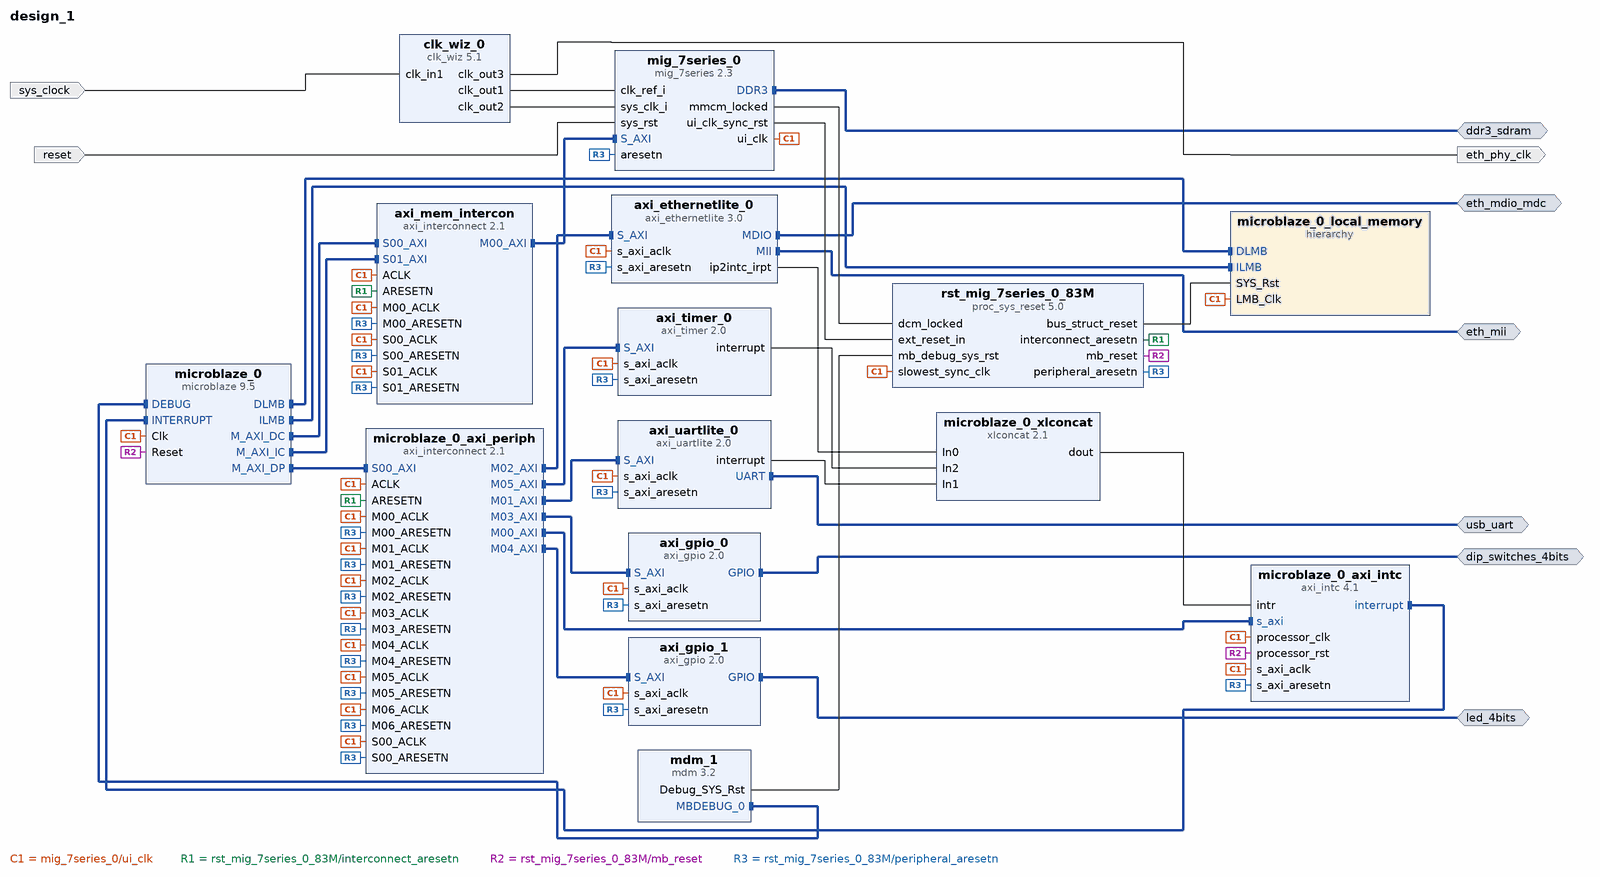
[diagram p0: block diagram of the top level]
# Vivado block design design_1, Vivado 2015.2
create_bd_design design_1

create_bd_intf_port -mode Master -vlnv xilinx.com:interface:ddrx_rtl:1.0 ddr3_sdram
create_bd_intf_port -mode Master -vlnv xilinx.com:interface:gpio_rtl:1.0 dip_switches_4bits
create_bd_intf_port -mode Master -vlnv xilinx.com:interface:mdio_rtl:1.0 eth_mdio_mdc
create_bd_intf_port -mode Master -vlnv xilinx.com:interface:mii_rtl:1.0 eth_mii
create_bd_intf_port -mode Master -vlnv xilinx.com:interface:gpio_rtl:1.0 led_4bits
create_bd_intf_port -mode Master -vlnv xilinx.com:interface:uart_rtl:1.0 usb_uart
create_bd_port -dir O -type clk eth_phy_clk
create_bd_port -dir I -type rst reset
set_property -dict {CONFIG.POLARITY ACTIVE_LOW} [get_bd_ports reset]
create_bd_port -dir I -type clk sys_clock
set_property -dict {CONFIG.FREQ_HZ 100000000 CONFIG.PHASE 0.000} [get_bd_ports sys_clock]

create_bd_cell -type ip -vlnv xilinx.com:ip:axi_ethernetlite:3.0 axi_ethernetlite_0
set_property -dict [list \
  CONFIG.C_S_AXI_PROTOCOL AXI4 \
  CONFIG.USE_BOARD_FLOW true \
  CONFIG.MII_BOARD_INTERFACE eth_mii \
  CONFIG.MDIO_BOARD_INTERFACE eth_mdio_mdc \
] [get_bd_cells axi_ethernetlite_0]
create_bd_cell -type ip -vlnv xilinx.com:ip:axi_gpio:2.0 axi_gpio_0
set_property -dict {CONFIG.USE_BOARD_FLOW true CONFIG.GPIO_BOARD_INTERFACE dip_switches_4bits} [get_bd_cells axi_gpio_0]
create_bd_cell -type ip -vlnv xilinx.com:ip:axi_gpio:2.0 axi_gpio_1
set_property -dict {CONFIG.USE_BOARD_FLOW true CONFIG.GPIO_BOARD_INTERFACE led_4bits} [get_bd_cells axi_gpio_1]
create_bd_cell -type ip -vlnv xilinx.com:ip:axi_interconnect:2.1 axi_mem_intercon
set_property -dict {CONFIG.NUM_SI 2 CONFIG.NUM_MI 1} [get_bd_cells axi_mem_intercon]
create_bd_cell -type ip -vlnv xilinx.com:ip:axi_timer:2.0 axi_timer_0
create_bd_cell -type ip -vlnv xilinx.com:ip:axi_uartlite:2.0 axi_uartlite_0
set_property -dict [list \
  CONFIG.C_BAUDRATE 115200 \
  CONFIG.USE_BOARD_FLOW true \
  CONFIG.UARTLITE_BOARD_INTERFACE usb_uart \
] [get_bd_cells axi_uartlite_0]
create_bd_cell -type ip -vlnv xilinx.com:ip:clk_wiz:5.1 clk_wiz_0
set_property -dict [list \
  CONFIG.CLKOUT2_USED true \
  CONFIG.CLKOUT3_USED true \
  CONFIG.NUM_OUT_CLKS 3 \
  CONFIG.CLKOUT1_REQUESTED_OUT_FREQ 200.000 \
  CONFIG.CLKOUT2_REQUESTED_OUT_FREQ 166.667 \
  CONFIG.CLKOUT3_REQUESTED_OUT_FREQ 25.000 \
  CONFIG.USE_LOCKED false \
  CONFIG.USE_RESET false \
  CONFIG.MMCM_DIVCLK_DIVIDE 1 \
  CONFIG.MMCM_CLKOUT0_DIVIDE_F 5.000 \
  CONFIG.MMCM_CLKOUT1_DIVIDE 6 \
  CONFIG.MMCM_CLKOUT2_DIVIDE 40 \
  CONFIG.USE_BOARD_FLOW true \
  CONFIG.CLK_IN1_BOARD_INTERFACE sys_clock \
  CONFIG.CLKOUT1_JITTER 114.829 \
  CONFIG.CLKOUT2_JITTER 118.758 \
  CONFIG.CLKOUT2_PHASE_ERROR 98.575 \
  CONFIG.CLKOUT3_JITTER 175.402 \
  CONFIG.CLKOUT3_PHASE_ERROR 98.575 \
] [get_bd_cells clk_wiz_0]
create_bd_cell -type ip -vlnv xilinx.com:ip:mdm:3.2 mdm_1
create_bd_cell -type ip -vlnv xilinx.com:ip:microblaze:9.5 microblaze_0
set_property -dict [list \
  CONFIG.C_AREA_OPTIMIZED 0 \
  CONFIG.C_D_AXI 1 \
  CONFIG.C_D_LMB 1 \
  CONFIG.C_I_LMB 1 \
  CONFIG.G_TEMPLATE_LIST 6 \
  CONFIG.G_USE_EXCEPTIONS 1 \
  CONFIG.C_USE_MSR_INSTR 1 \
  CONFIG.C_USE_PCMP_INSTR 1 \
  CONFIG.C_USE_BARREL 1 \
  CONFIG.C_USE_DIV 1 \
  CONFIG.C_USE_HW_MUL 1 \
  CONFIG.C_UNALIGNED_EXCEPTIONS 0 \
  CONFIG.C_ILL_OPCODE_EXCEPTION 0 \
  CONFIG.C_M_AXI_I_BUS_EXCEPTION 0 \
  CONFIG.C_M_AXI_D_BUS_EXCEPTION 1 \
  CONFIG.C_DEBUG_ENABLED 1 \
  CONFIG.C_NUMBER_OF_PC_BRK 2 \
  CONFIG.C_OPCODE_0x0_ILLEGAL 0 \
  CONFIG.C_USE_ICACHE 1 \
  CONFIG.C_CACHE_BYTE_SIZE 32768 \
  CONFIG.C_ICACHE_LINE_LEN 8 \
  CONFIG.C_USE_DCACHE 1 \
  CONFIG.C_DCACHE_BYTE_SIZE 32768 \
  CONFIG.C_DCACHE_LINE_LEN 8 \
  CONFIG.C_USE_MMU 0 \
  CONFIG.C_USE_BRANCH_TARGET_CACHE 0 \
] [get_bd_cells microblaze_0]
create_bd_cell -type ip -vlnv xilinx.com:ip:axi_intc:4.1 microblaze_0_axi_intc
set_property -dict {CONFIG.C_HAS_FAST 1} [get_bd_cells microblaze_0_axi_intc]
create_bd_cell -type ip -vlnv xilinx.com:ip:axi_interconnect:2.1 microblaze_0_axi_periph
set_property -dict {CONFIG.NUM_MI 7} [get_bd_cells microblaze_0_axi_periph]
create_bd_cell -type hier microblaze_0_local_memory
create_bd_cell -type ip -vlnv xilinx.com:ip:xlconcat:2.1 microblaze_0_xlconcat
set_property -dict {CONFIG.NUM_PORTS 3} [get_bd_cells microblaze_0_xlconcat]
create_bd_cell -type ip -vlnv xilinx.com:ip:mig_7series:2.3 mig_7series_0
set_property -dict {CONFIG.RESET_BOARD_INTERFACE reset CONFIG.BOARD_MIG_PARAM ddr3_sdram} [get_bd_cells mig_7series_0]
create_bd_cell -type ip -vlnv xilinx.com:ip:proc_sys_reset:5.0 rst_mig_7series_0_83M

# ---- hierarchy /microblaze_0_local_memory ----
current_bd_instance /microblaze_0_local_memory
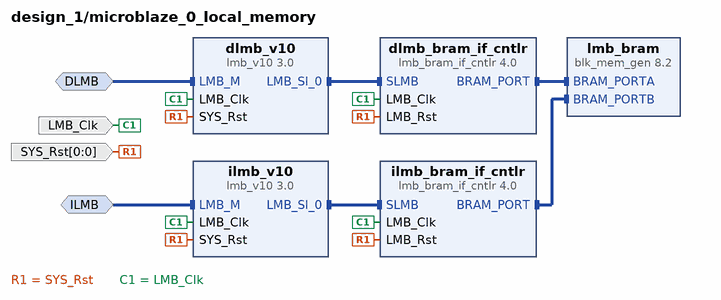
[diagram p1: block diagram inside /microblaze_0_local_memory]
create_bd_intf_pin -mode MirroredMaster -vlnv xilinx.com:interface:lmb_rtl:1.0 DLMB
create_bd_intf_pin -mode MirroredMaster -vlnv xilinx.com:interface:lmb_rtl:1.0 ILMB
create_bd_pin -dir I -type clk LMB_Clk
create_bd_pin -dir I -from 0 -to 0 -type rst SYS_Rst

create_bd_cell -type ip -vlnv xilinx.com:ip:lmb_bram_if_cntlr:4.0 dlmb_bram_if_cntlr
set_property -dict {CONFIG.C_ECC 0} [get_bd_cells dlmb_bram_if_cntlr]
create_bd_cell -type ip -vlnv xilinx.com:ip:lmb_v10:3.0 dlmb_v10
create_bd_cell -type ip -vlnv xilinx.com:ip:lmb_bram_if_cntlr:4.0 ilmb_bram_if_cntlr
set_property -dict {CONFIG.C_ECC 0} [get_bd_cells ilmb_bram_if_cntlr]
create_bd_cell -type ip -vlnv xilinx.com:ip:lmb_v10:3.0 ilmb_v10
create_bd_cell -type ip -vlnv xilinx.com:ip:blk_mem_gen:8.2 lmb_bram
set_property -dict {CONFIG.Memory_Type True_Dual_Port_RAM CONFIG.use_bram_block BRAM_Controller} [get_bd_cells lmb_bram]

# ---- connections ----

current_bd_instance /microblaze_0_local_memory
connect_bd_intf_net -intf_net microblaze_0_dlmb_bus [get_bd_intf_pins dlmb_bram_if_cntlr/SLMB] [get_bd_intf_pins dlmb_v10/LMB_Sl_0]
connect_bd_intf_net -intf_net microblaze_0_dlmb_cntlr [get_bd_intf_pins dlmb_bram_if_cntlr/BRAM_PORT] [get_bd_intf_pins lmb_bram/BRAM_PORTA]
connect_bd_intf_net -intf_net microblaze_0_ilmb_bus [get_bd_intf_pins ilmb_bram_if_cntlr/SLMB] [get_bd_intf_pins ilmb_v10/LMB_Sl_0]
connect_bd_intf_net -intf_net microblaze_0_ilmb_cntlr [get_bd_intf_pins ilmb_bram_if_cntlr/BRAM_PORT] [get_bd_intf_pins lmb_bram/BRAM_PORTB]
connect_bd_intf_net -intf_net microblaze_0_dlmb [get_bd_intf_pins DLMB] [get_bd_intf_pins dlmb_v10/LMB_M]
connect_bd_intf_net -intf_net microblaze_0_ilmb [get_bd_intf_pins ILMB] [get_bd_intf_pins ilmb_v10/LMB_M]
connect_bd_net [get_bd_pins SYS_Rst] \
  [get_bd_pins dlmb_bram_if_cntlr/LMB_Rst] [get_bd_pins dlmb_v10/SYS_Rst] [get_bd_pins ilmb_bram_if_cntlr/LMB_Rst] \
  [get_bd_pins ilmb_v10/SYS_Rst]
connect_bd_net -net microblaze_0_Clk [get_bd_pins LMB_Clk] \
  [get_bd_pins dlmb_bram_if_cntlr/LMB_Clk] [get_bd_pins dlmb_v10/LMB_Clk] [get_bd_pins ilmb_bram_if_cntlr/LMB_Clk] \
  [get_bd_pins ilmb_v10/LMB_Clk]

current_bd_instance /
connect_bd_intf_net [get_bd_intf_pins axi_mem_intercon/M00_AXI] [get_bd_intf_pins mig_7series_0/S_AXI]
connect_bd_intf_net [get_bd_intf_pins axi_mem_intercon/S00_AXI] [get_bd_intf_pins microblaze_0/M_AXI_DC]
connect_bd_intf_net [get_bd_intf_pins axi_mem_intercon/S01_AXI] [get_bd_intf_pins microblaze_0/M_AXI_IC]
connect_bd_intf_net -intf_net microblaze_0_axi_dp [get_bd_intf_pins microblaze_0/M_AXI_DP] [get_bd_intf_pins microblaze_0_axi_periph/S00_AXI]
connect_bd_intf_net [get_bd_intf_pins axi_uartlite_0/S_AXI] [get_bd_intf_pins microblaze_0_axi_periph/M01_AXI]
connect_bd_intf_net [get_bd_intf_pins axi_ethernetlite_0/S_AXI] [get_bd_intf_pins microblaze_0_axi_periph/M02_AXI]
connect_bd_intf_net [get_bd_intf_pins axi_gpio_0/S_AXI] [get_bd_intf_pins microblaze_0_axi_periph/M03_AXI]
connect_bd_intf_net [get_bd_intf_pins axi_gpio_1/S_AXI] [get_bd_intf_pins microblaze_0_axi_periph/M04_AXI]
connect_bd_intf_net [get_bd_intf_pins axi_timer_0/S_AXI] [get_bd_intf_pins microblaze_0_axi_periph/M05_AXI]
connect_bd_intf_net [get_bd_intf_pins mdm_1/MBDEBUG_0] [get_bd_intf_pins microblaze_0/DEBUG]
connect_bd_intf_net [get_bd_intf_pins microblaze_0/DLMB] [get_bd_intf_pins microblaze_0_local_memory/DLMB]
connect_bd_intf_net [get_bd_intf_pins microblaze_0/ILMB] [get_bd_intf_pins microblaze_0_local_memory/ILMB]
connect_bd_intf_net -intf_net microblaze_0_intc_axi [get_bd_intf_pins microblaze_0_axi_intc/s_axi] [get_bd_intf_pins microblaze_0_axi_periph/M00_AXI]
connect_bd_intf_net [get_bd_intf_pins microblaze_0/INTERRUPT] [get_bd_intf_pins microblaze_0_axi_intc/interrupt]
connect_bd_intf_net [get_bd_intf_ports ddr3_sdram] [get_bd_intf_pins mig_7series_0/DDR3]
connect_bd_intf_net [get_bd_intf_ports dip_switches_4bits] [get_bd_intf_pins axi_gpio_0/GPIO]
connect_bd_intf_net [get_bd_intf_ports eth_mdio_mdc] [get_bd_intf_pins axi_ethernetlite_0/MDIO]
connect_bd_intf_net [get_bd_intf_ports eth_mii] [get_bd_intf_pins axi_ethernetlite_0/MII]
connect_bd_intf_net [get_bd_intf_ports led_4bits] [get_bd_intf_pins axi_gpio_1/GPIO]
connect_bd_intf_net [get_bd_intf_ports usb_uart] [get_bd_intf_pins axi_uartlite_0/UART]
connect_bd_net [get_bd_pins axi_ethernetlite_0/ip2intc_irpt] [get_bd_pins microblaze_0_xlconcat/In0]
connect_bd_net [get_bd_pins axi_timer_0/interrupt] [get_bd_pins microblaze_0_xlconcat/In2]
connect_bd_net [get_bd_pins axi_uartlite_0/interrupt] [get_bd_pins microblaze_0_xlconcat/In1]
connect_bd_net [get_bd_pins clk_wiz_0/clk_out1] [get_bd_pins mig_7series_0/clk_ref_i]
connect_bd_net [get_bd_pins clk_wiz_0/clk_out2] [get_bd_pins mig_7series_0/sys_clk_i]
connect_bd_net [get_bd_pins clk_wiz_0/clk_out3] [get_bd_ports eth_phy_clk]
connect_bd_net [get_bd_pins mdm_1/Debug_SYS_Rst] [get_bd_pins rst_mig_7series_0_83M/mb_debug_sys_rst]
connect_bd_net -net microblaze_0_Clk [get_bd_pins mig_7series_0/ui_clk] \
  [get_bd_pins axi_ethernetlite_0/s_axi_aclk] [get_bd_pins axi_gpio_0/s_axi_aclk] [get_bd_pins axi_gpio_1/s_axi_aclk] \
  [get_bd_pins axi_mem_intercon/ACLK] [get_bd_pins axi_mem_intercon/M00_ACLK] [get_bd_pins axi_mem_intercon/S00_ACLK] \
  [get_bd_pins axi_mem_intercon/S01_ACLK] [get_bd_pins axi_timer_0/s_axi_aclk] [get_bd_pins axi_uartlite_0/s_axi_aclk] \
  [get_bd_pins microblaze_0/Clk] [get_bd_pins microblaze_0_axi_intc/processor_clk] \
  [get_bd_pins microblaze_0_axi_intc/s_axi_aclk] [get_bd_pins microblaze_0_axi_periph/ACLK] \
  [get_bd_pins microblaze_0_axi_periph/M00_ACLK] [get_bd_pins microblaze_0_axi_periph/M01_ACLK] \
  [get_bd_pins microblaze_0_axi_periph/M02_ACLK] [get_bd_pins microblaze_0_axi_periph/M03_ACLK] \
  [get_bd_pins microblaze_0_axi_periph/M04_ACLK] [get_bd_pins microblaze_0_axi_periph/M05_ACLK] \
  [get_bd_pins microblaze_0_axi_periph/M06_ACLK] [get_bd_pins microblaze_0_axi_periph/S00_ACLK] \
  [get_bd_pins microblaze_0_local_memory/LMB_Clk] [get_bd_pins rst_mig_7series_0_83M/slowest_sync_clk]
connect_bd_net -net microblaze_0_intr [get_bd_pins microblaze_0_xlconcat/dout] [get_bd_pins microblaze_0_axi_intc/intr]
connect_bd_net [get_bd_pins mig_7series_0/mmcm_locked] [get_bd_pins rst_mig_7series_0_83M/dcm_locked]
connect_bd_net [get_bd_pins mig_7series_0/ui_clk_sync_rst] [get_bd_pins rst_mig_7series_0_83M/ext_reset_in]
connect_bd_net [get_bd_ports reset] [get_bd_pins mig_7series_0/sys_rst]
connect_bd_net [get_bd_pins rst_mig_7series_0_83M/bus_struct_reset] [get_bd_pins microblaze_0_local_memory/SYS_Rst]
connect_bd_net [get_bd_pins rst_mig_7series_0_83M/interconnect_aresetn] \
  [get_bd_pins axi_mem_intercon/ARESETN] [get_bd_pins microblaze_0_axi_periph/ARESETN]
connect_bd_net [get_bd_pins rst_mig_7series_0_83M/mb_reset] [get_bd_pins microblaze_0/Reset] [get_bd_pins microblaze_0_axi_intc/processor_rst]
connect_bd_net [get_bd_pins rst_mig_7series_0_83M/peripheral_aresetn] \
  [get_bd_pins axi_ethernetlite_0/s_axi_aresetn] [get_bd_pins axi_gpio_0/s_axi_aresetn] \
  [get_bd_pins axi_gpio_1/s_axi_aresetn] [get_bd_pins axi_mem_intercon/M00_ARESETN] \
  [get_bd_pins axi_mem_intercon/S00_ARESETN] [get_bd_pins axi_mem_intercon/S01_ARESETN] \
  [get_bd_pins axi_timer_0/s_axi_aresetn] [get_bd_pins axi_uartlite_0/s_axi_aresetn] \
  [get_bd_pins microblaze_0_axi_intc/s_axi_aresetn] [get_bd_pins microblaze_0_axi_periph/M00_ARESETN] \
  [get_bd_pins microblaze_0_axi_periph/M01_ARESETN] [get_bd_pins microblaze_0_axi_periph/M02_ARESETN] \
  [get_bd_pins microblaze_0_axi_periph/M03_ARESETN] [get_bd_pins microblaze_0_axi_periph/M04_ARESETN] \
  [get_bd_pins microblaze_0_axi_periph/M05_ARESETN] [get_bd_pins microblaze_0_axi_periph/M06_ARESETN] \
  [get_bd_pins microblaze_0_axi_periph/S00_ARESETN] [get_bd_pins mig_7series_0/aresetn]
connect_bd_net [get_bd_ports sys_clock] [get_bd_pins clk_wiz_0/clk_in1]

# ---- address map ----
assign_bd_address -offset 0x00000000 -range 16K -target_address_space [get_bd_addr_spaces microblaze_0/Data] [get_bd_addr_segs microblaze_0_local_memory/dlmb_bram_if_cntlr/SLMB/Mem]
assign_bd_address -offset 0x40000000 -range 64K -target_address_space [get_bd_addr_spaces microblaze_0/Data] [get_bd_addr_segs axi_gpio_0/S_AXI/Reg]
assign_bd_address -offset 0x40010000 -range 64K -target_address_space [get_bd_addr_spaces microblaze_0/Data] [get_bd_addr_segs axi_gpio_1/S_AXI/Reg]
assign_bd_address -offset 0x40600000 -range 64K -target_address_space [get_bd_addr_spaces microblaze_0/Data] [get_bd_addr_segs axi_uartlite_0/S_AXI/Reg]
assign_bd_address -offset 0x40E00000 -range 64K -target_address_space [get_bd_addr_spaces microblaze_0/Data] [get_bd_addr_segs axi_ethernetlite_0/S_AXI/Reg]
assign_bd_address -offset 0x41200000 -range 64K -target_address_space [get_bd_addr_spaces microblaze_0/Data] [get_bd_addr_segs microblaze_0_axi_intc/s_axi/Reg]
assign_bd_address -offset 0x41C00000 -range 64K -target_address_space [get_bd_addr_spaces microblaze_0/Data] [get_bd_addr_segs axi_timer_0/S_AXI/Reg]
assign_bd_address -offset 0x80000000 -range 256M -target_address_space [get_bd_addr_spaces microblaze_0/Data] [get_bd_addr_segs mig_7series_0/memmap/memaddr]
assign_bd_address -offset 0x00000000 -range 16K -target_address_space [get_bd_addr_spaces microblaze_0/Instruction] [get_bd_addr_segs microblaze_0_local_memory/ilmb_bram_if_cntlr/SLMB/Mem]
assign_bd_address -offset 0x80000000 -range 256M -target_address_space [get_bd_addr_spaces microblaze_0/Instruction] [get_bd_addr_segs mig_7series_0/memmap/memaddr]

validate_bd_design
save_bd_design
